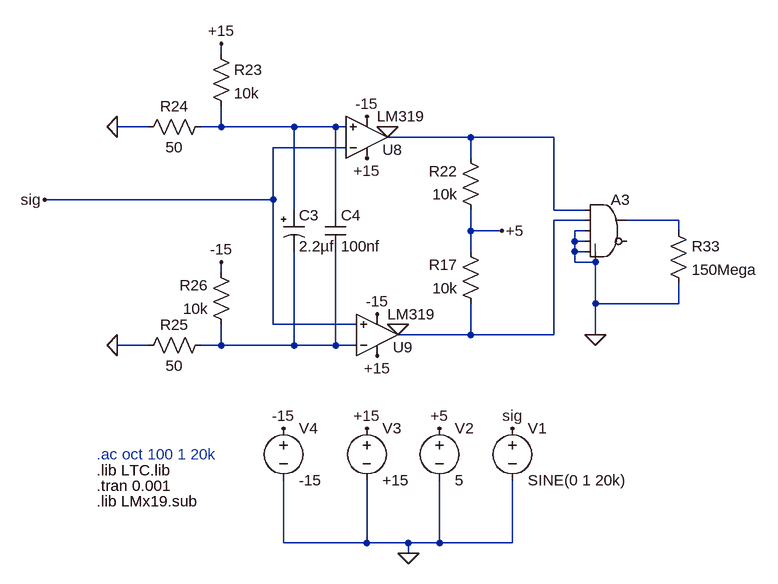
[diagram p0: schematic ZCD.asc]
ZCD.asc, the LTspice schematic file:
Version 4
SHEET 1 2196 1424
WIRE 16 -1984 16 -2000
WIRE -96 -1872 -144 -1872
WIRE 16 -1872 16 -1904
WIRE 16 -1872 -16 -1872
WIRE 128 -1872 16 -1872
WIRE 192 -1872 128 -1872
WIRE 208 -1872 192 -1872
WIRE 400 -1856 272 -1856
WIRE 528 -1856 400 -1856
WIRE 208 -1840 96 -1840
WIRE 400 -1824 400 -1856
WIRE 96 -1760 96 -1840
WIRE 96 -1760 -256 -1760
WIRE 128 -1744 128 -1872
WIRE 192 -1744 192 -1872
WIRE 528 -1744 528 -1856
WIRE 576 -1744 528 -1744
WIRE 576 -1728 528 -1728
WIRE 720 -1728 640 -1728
WIRE 400 -1712 400 -1744
WIRE 448 -1712 400 -1712
WIRE 576 -1712 560 -1712
WIRE 720 -1712 720 -1728
WIRE 560 -1696 560 -1712
WIRE 576 -1696 560 -1696
WIRE 400 -1680 400 -1712
WIRE 560 -1680 560 -1696
WIRE 576 -1680 560 -1680
WIRE 560 -1664 560 -1680
WIRE 592 -1664 592 -1680
WIRE 592 -1664 560 -1664
WIRE 16 -1648 16 -1664
WIRE 592 -1600 592 -1664
WIRE 720 -1600 720 -1632
WIRE 720 -1600 592 -1600
WIRE 96 -1568 96 -1760
WIRE 224 -1568 96 -1568
WIRE 400 -1552 400 -1600
WIRE 400 -1552 288 -1552
WIRE 528 -1552 528 -1728
WIRE 528 -1552 400 -1552
WIRE 592 -1552 592 -1600
WIRE -96 -1536 -144 -1536
WIRE 16 -1536 16 -1568
WIRE 16 -1536 -16 -1536
WIRE 128 -1536 128 -1680
WIRE 128 -1536 16 -1536
WIRE 192 -1536 192 -1680
WIRE 192 -1536 128 -1536
WIRE 224 -1536 192 -1536
WIRE 112 -1232 112 -1328
WIRE 240 -1232 240 -1328
WIRE 240 -1232 112 -1232
WIRE 304 -1232 240 -1232
WIRE 352 -1232 352 -1328
WIRE 352 -1232 304 -1232
WIRE 464 -1232 464 -1328
WIRE 464 -1232 352 -1232
WIRE 304 -1216 304 -1232
FLAG 352 -1408 +5
FLAG 240 -1408 +15
FLAG 112 -1408 -15
FLAG 304 -1216 0
FLAG 464 -1408 sig
FLAG 448 -1712 +5
FLAG 592 -1552 0
FLAG -144 -1872 0
FLAG 16 -2000 +15
FLAG -144 -1536 0
FLAG 16 -1664 -15
FLAG 256 -1584 -15
FLAG 256 -1520 +15
FLAG 288 -1568 0
FLAG 240 -1888 -15
FLAG 240 -1824 +15
FLAG 272 -1872 0
FLAG -256 -1760 sig
SYMBOL voltage 464 -1424 R0
SYMATTR InstName V1
SYMATTR Value SINE(0 1 20k)
SYMATTR Value2 AC 1
SYMBOL voltage 352 -1424 R0
SYMATTR InstName V2
SYMATTR Value 5
SYMBOL voltage 240 -1424 R0
SYMATTR InstName V3
SYMATTR Value +15
SYMBOL voltage 112 -1424 R0
SYMATTR InstName V4
SYMATTR Value -15
SYMBOL res 416 -1584 R180
WINDOW 0 36 76 Left 2
WINDOW 3 36 40 Left 2
SYMATTR InstName R17
SYMATTR Value 10k
SYMBOL res 416 -1728 R180
WINDOW 0 36 76 Left 2
WINDOW 3 36 40 Left 2
SYMATTR InstName R22
SYMATTR Value 10k
SYMBOL Digital/and 608 -1776 R0
SYMATTR InstName A3
SYMATTR Value2 vhigh = 5V ref = 2.5v td = 5ns
SYMBOL res 0 -2000 R0
SYMATTR InstName R23
SYMATTR Value 10k
SYMBOL res 0 -1888 R90
WINDOW 0 0 56 VBottom 2
WINDOW 3 32 56 VTop 2
SYMATTR InstName R24
SYMATTR Value 50
SYMBOL res 0 -1552 R90
WINDOW 0 0 56 VBottom 2
WINDOW 3 32 56 VTop 2
SYMATTR InstName R25
SYMATTR Value 50
SYMBOL res 32 -1552 R180
WINDOW 0 36 76 Left 2
WINDOW 3 36 40 Left 2
SYMATTR InstName R26
SYMATTR Value 10k
SYMBOL LMx19 256 -1488 M180
WINDOW 0 24 45 Left 2
SYMATTR InstName U9
SYMATTR Value LM319
SYMBOL LMx19 240 -1792 M180
WINDOW 0 24 45 Left 2
SYMATTR InstName U8
SYMATTR Value LM319
SYMBOL res 704 -1728 R0
SYMATTR InstName R33
SYMATTR Value 150Mega
SYMBOL cap 176 -1744 R0
SYMATTR InstName C4
SYMATTR Value 100nf
SYMBOL polcap 112 -1744 R0
SYMATTR InstName C3
SYMATTR Value 2.2µf
TEXT -176 -1320 Left 2 !.tran 0.001
TEXT -176 -1344 Left 2 !.lib LTC.lib
TEXT -176 -1368 Left 2 ;.ac oct 100 1 20k
TEXT -176 -1296 Left 2 !.lib LMx19.sub

The netlist it stands for:
* ZCD.asc
V1 sig 0 SINE(0 1 20k) AC 1
V2 +5 0 5
V3 +15 0 +15
V4 -15 0 -15
R17 N003 +5 10k
R22 +5 N002 10k
A3 N002 N003 0 0 0 0 N004 0 AND vhigh = 5V ref = 2.5v td = 5ns
R23 +15 N001 10k
R24 N001 0 50
R25 N005 0 50
R26 N005 -15 10k
* U9: LM319 (symbol LMx19 not available, pins judged from their places): In+=sig In-=N005 V+=+15 V-=-15 OUT=N003
* U8: LM319 (symbol LMx19 not available, pins judged from their places): In+=N001 In-=sig V+=+15 V-=-15 OUT=N002
R33 N004 0 150Mega
C4 N001 N005 100nf
C3 N001 N005 2.2µf
.tran 0.001
.lib LTC.lib
* .ac oct 100 1 20k
.lib LMx19.sub
.backanno
.end